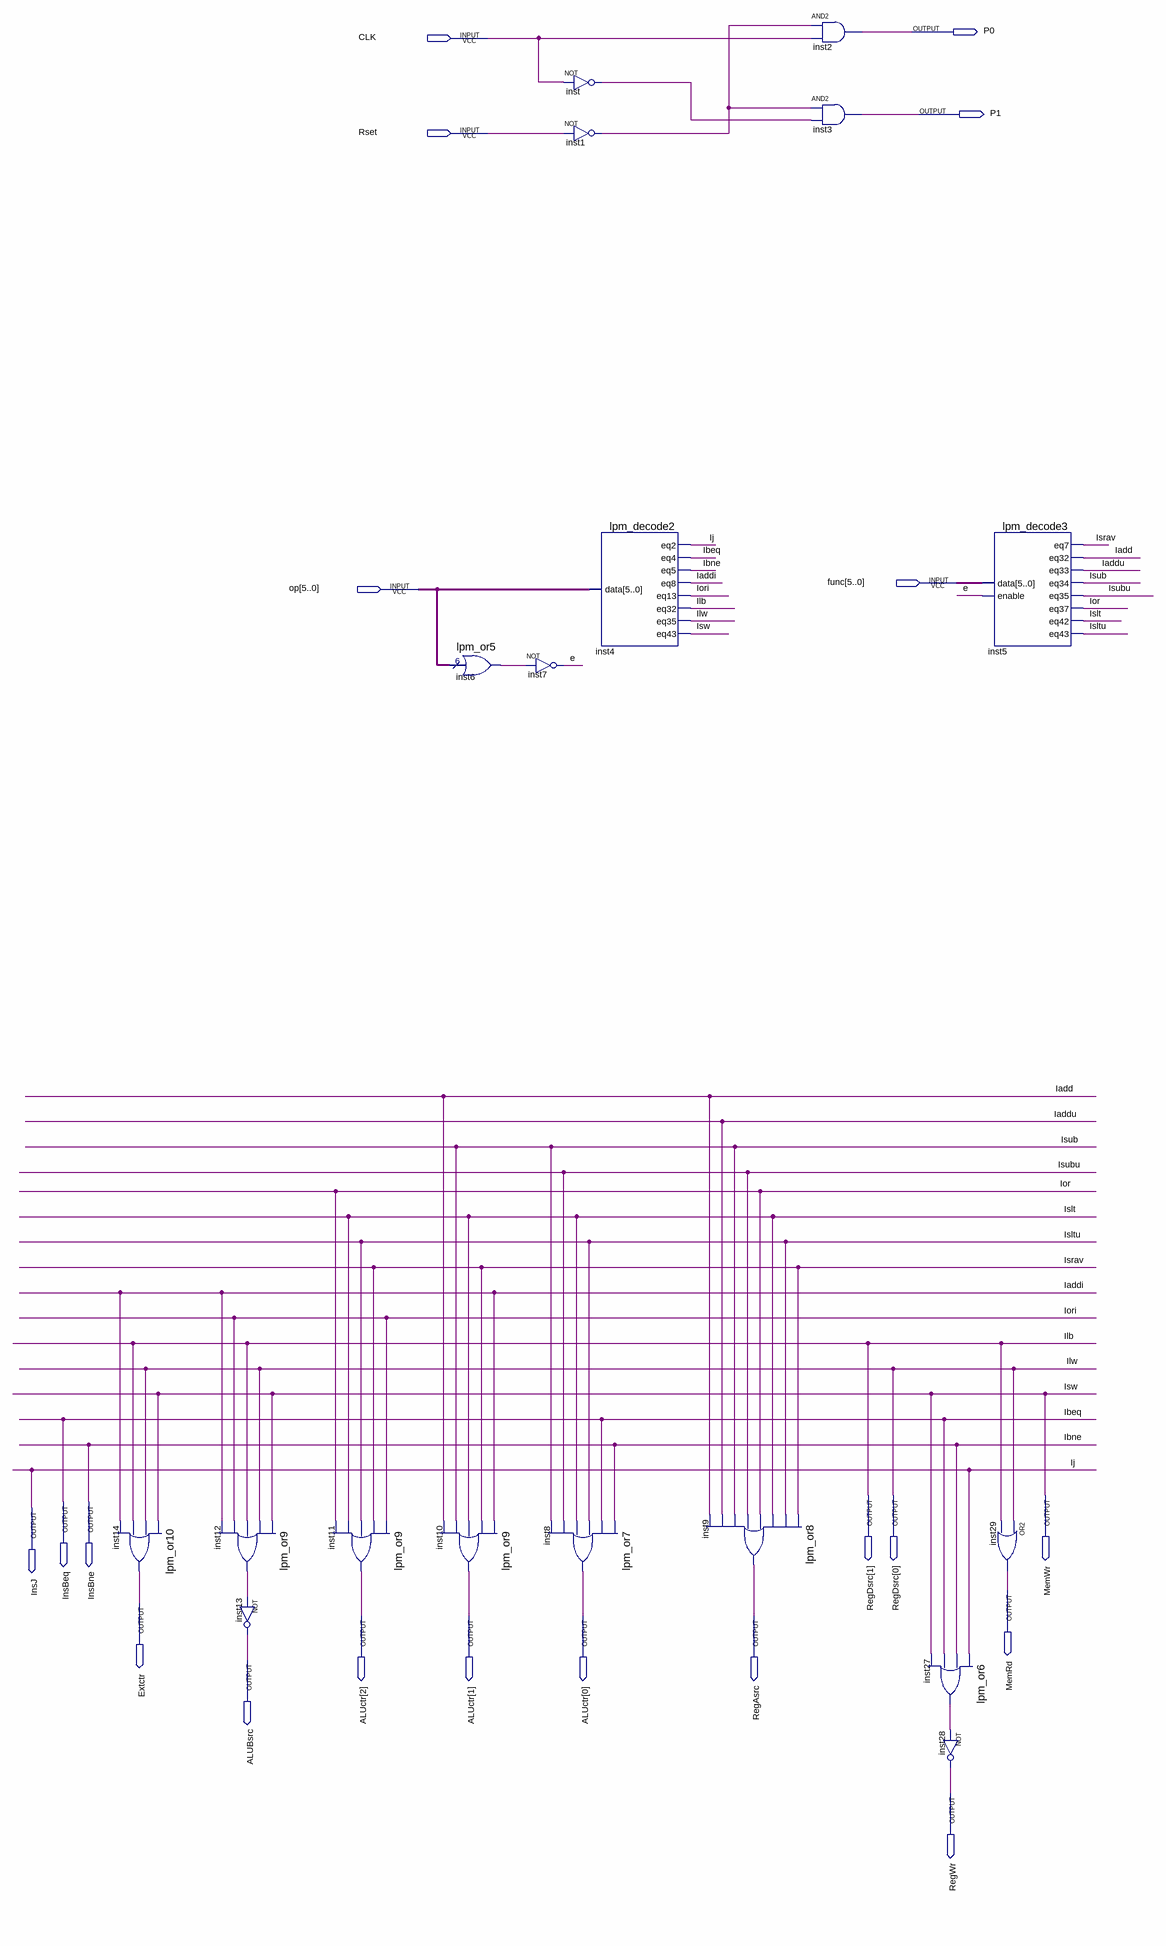
[diagram p0: schematic sheet]
// Quartus schematic CU.bdf as structural Verilog: 18 symbols, 20 pins
module CU (
  input  CLK,
  input  Rset,
  input  [5:0] func,
  input  [5:0] op,
  output P0,
  output P1,
  output [1:0] RegDsrc,
  output MemWr,
  output InsBeq,
  output InsBne,
  output InsJ,
  output MemRd,
  output Extctr,
  output [2:0] ALUctr,
  output RegAsrc,
  output ALUBsrc,
  output RegWr
);

  wire e, Iadd, Iaddi, Iaddu, inst1_out, inst6_result, inst12_result, inst27_result, inst_out, Ior, Iori,
       Islt, Isltu, Israv, Isub, Isubu;

  lpm_or10 inst14 (.data0(MemWr), .data1(RegDsrc[0]), .data2(RegDsrc[1]), .data3(Iaddi), .result(Extctr));
  lpm_or9 inst12 (
    .data0(MemWr), .data1(RegDsrc[0]), .data2(RegDsrc[1]), .data3(Iori), .data4(Iaddi), .result(inst12_result));
  not inst13 (ALUBsrc, inst12_result);
  lpm_or9 inst11 (.data0(Iori), .data1(Israv), .data2(Isltu), .data3(Islt), .data4(Ior), .result(ALUctr[2]));
  lpm_or9 inst10 (.data0(Iaddi), .data1(Israv), .data2(Islt), .data3(Isub), .data4(Iadd), .result(ALUctr[1]));
  lpm_or5 inst6 (.data(op), .result(inst6_result));
  not inst7 (e, inst6_result);
  not inst (inst_out, CLK);
  not inst1 (inst1_out, Rset);
  lpm_or7 inst8 (
    .data0(InsBne), .data1(InsBeq), .data2(Isltu), .data3(Islt), .data4(Isubu), .data5(Isub),
    .result(ALUctr[0]));
  lpm_decode2 inst4 (
    .data(op), .eq2(InsJ), .eq4(InsBeq), .eq5(InsBne), .eq8(Iaddi), .eq13(Iori), .eq32(RegDsrc[1]),
    .eq35(RegDsrc[0]), .eq43(MemWr));
  lpm_or8 inst9 (
    .data0(Israv), .data1(Isltu), .data2(Islt), .data3(Ior), .data4(Isubu), .data5(Isub), .data6(Iaddu),
    .data7(Iadd), .result(RegAsrc));
  and inst2 (P0, inst1_out, CLK);
  and inst3 (P1, inst1_out, inst_out);
  lpm_or6 inst27 (.data0(InsJ), .data1(InsBne), .data2(InsBeq), .data3(MemWr), .result(inst27_result));
  not inst28 (RegWr, inst27_result);
  lpm_decode3 inst5 (
    .data(func), .enable(e), .eq7(Israv), .eq32(Iadd), .eq33(Iaddu), .eq34(Isub), .eq35(Isubu), .eq37(Ior),
    .eq42(Islt), .eq43(Isltu));
  or inst29 (MemRd, RegDsrc[0], RegDsrc[1]);

  // Other names for the same wires on the sheet: Ibeq = InsBeq; Ibne = InsBne; Ij = InsJ; Isw = MemWr;
  //   Ilw = RegDsrc[0]; Ilb = RegDsrc[1]
endmodule
